# EAGLE design EduRobController (EAGLE 9.6.2)
REV: 1.0.0

## Sheet 1 of 3: Logic
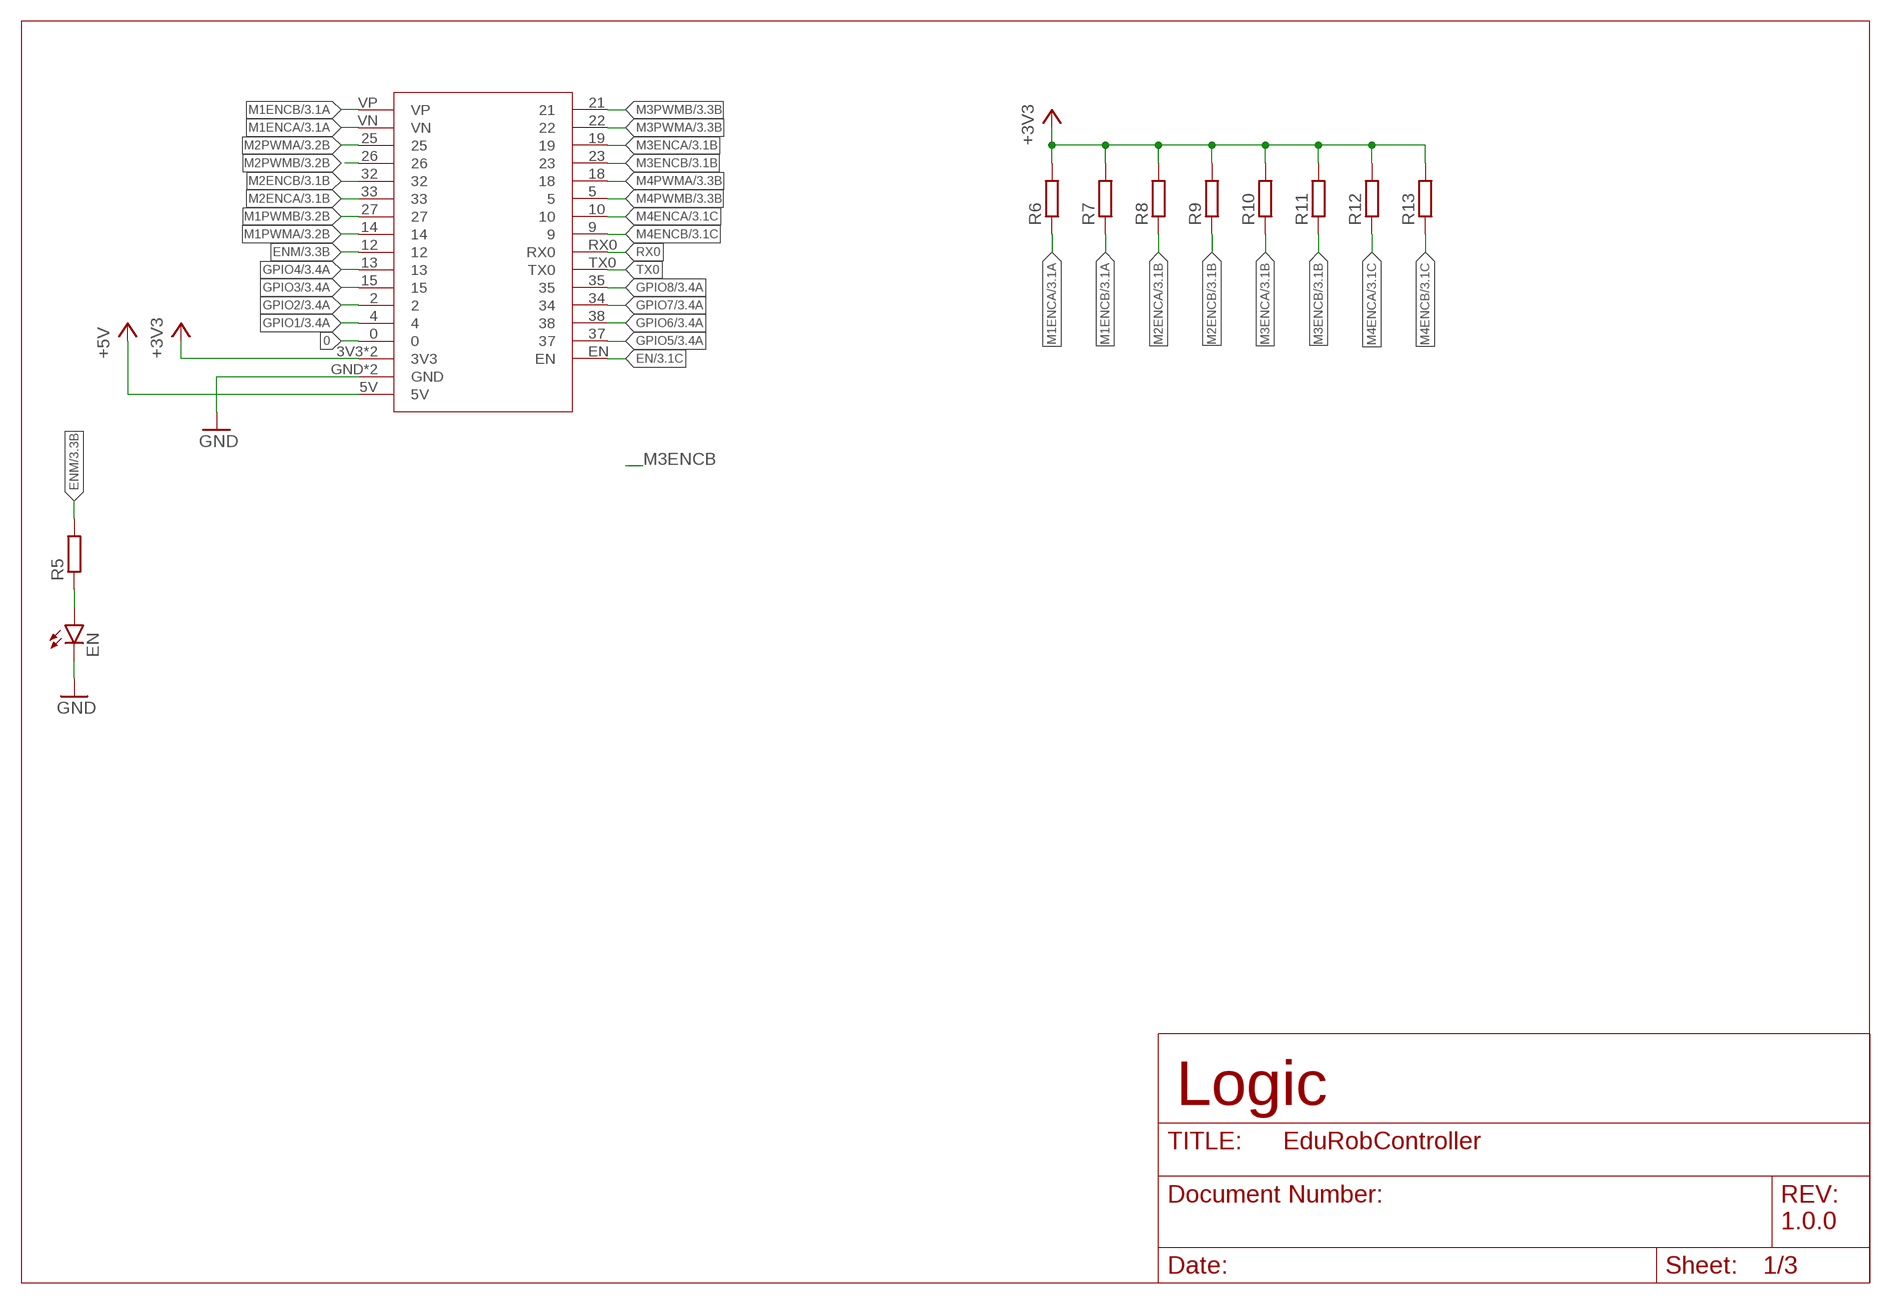
[diagram p0: schematic, sheet 1]

### Parts
EN  LEDCHIP-LED0805  [CHIP-LED0805]
R5  R-EU_R0805  [R0805]
R6  R-EU_R0603  [R0603]
R7  R-EU_R0603  [R0603]
R8  R-EU_R0603  [R0603]
R9  R-EU_R0603  [R0603]
R10  R-EU_R0603  [R0603]
R11  R-EU_R0603  [R0603]
R12  R-EU_R0603  [R0603]
R13  R-EU_R0603  [R0603]
U$1  ESP32  [ESP32]

### Nets
0: U$1.0
+3V3: R6.2 R7.2 R8.2 R9.2 R10.2 R11.2 R12.2 R13.2 U$1.3V3 U$1.3V3.(3V3) ; also sheet 2,3
+5V: U$1.5V ; also sheet 2,3
EN: U$1.EN ; also sheet 3
ENM: R5.2 U$1.12 ; also sheet 3
GND: EN.C U$1.GND U$1.GND.(GND) ; also sheet 2,3
GPIO1: U$1.4 ; also sheet 3
GPIO2: U$1.2 ; also sheet 3
GPIO3: U$1.15 ; also sheet 3
GPIO4: U$1.13 ; also sheet 3
GPIO5: U$1.37 ; also sheet 3
GPIO6: U$1.38 ; also sheet 3
GPIO7: U$1.34 ; also sheet 3
GPIO8: U$1.35 ; also sheet 3
M1ENCA: R6.1 U$1.VN ; also sheet 3
M1ENCB: R7.1 U$1.VP ; also sheet 3
M1PWMA: U$1.14 ; also sheet 3
M1PWMB: U$1.27 ; also sheet 3
M2ENCA: R8.1 U$1.33 ; also sheet 3
M2ENCB: R9.1 U$1.32 ; also sheet 3
M2PWMA: U$1.25 ; also sheet 3
M2PWMB: U$1.26 ; also sheet 3
M3ENCA: R10.1 U$1.19 ; also sheet 3
M3ENCB: R11.1 U$1.23 ; also sheet 3
M3PWMA: U$1.22 ; also sheet 3
M3PWMB: U$1.21 ; also sheet 3
M4ENCA: R12.1 U$1.10 ; also sheet 3
M4ENCB: R13.1 U$1.9 ; also sheet 3
M4PWMA: U$1.18 ; also sheet 3
M4PWMB: U$1.5 ; also sheet 3
N$7: EN.A R5.1
RX0: U$1.RX0
TX0: U$1.TX0

## Sheet 2 of 3: Power
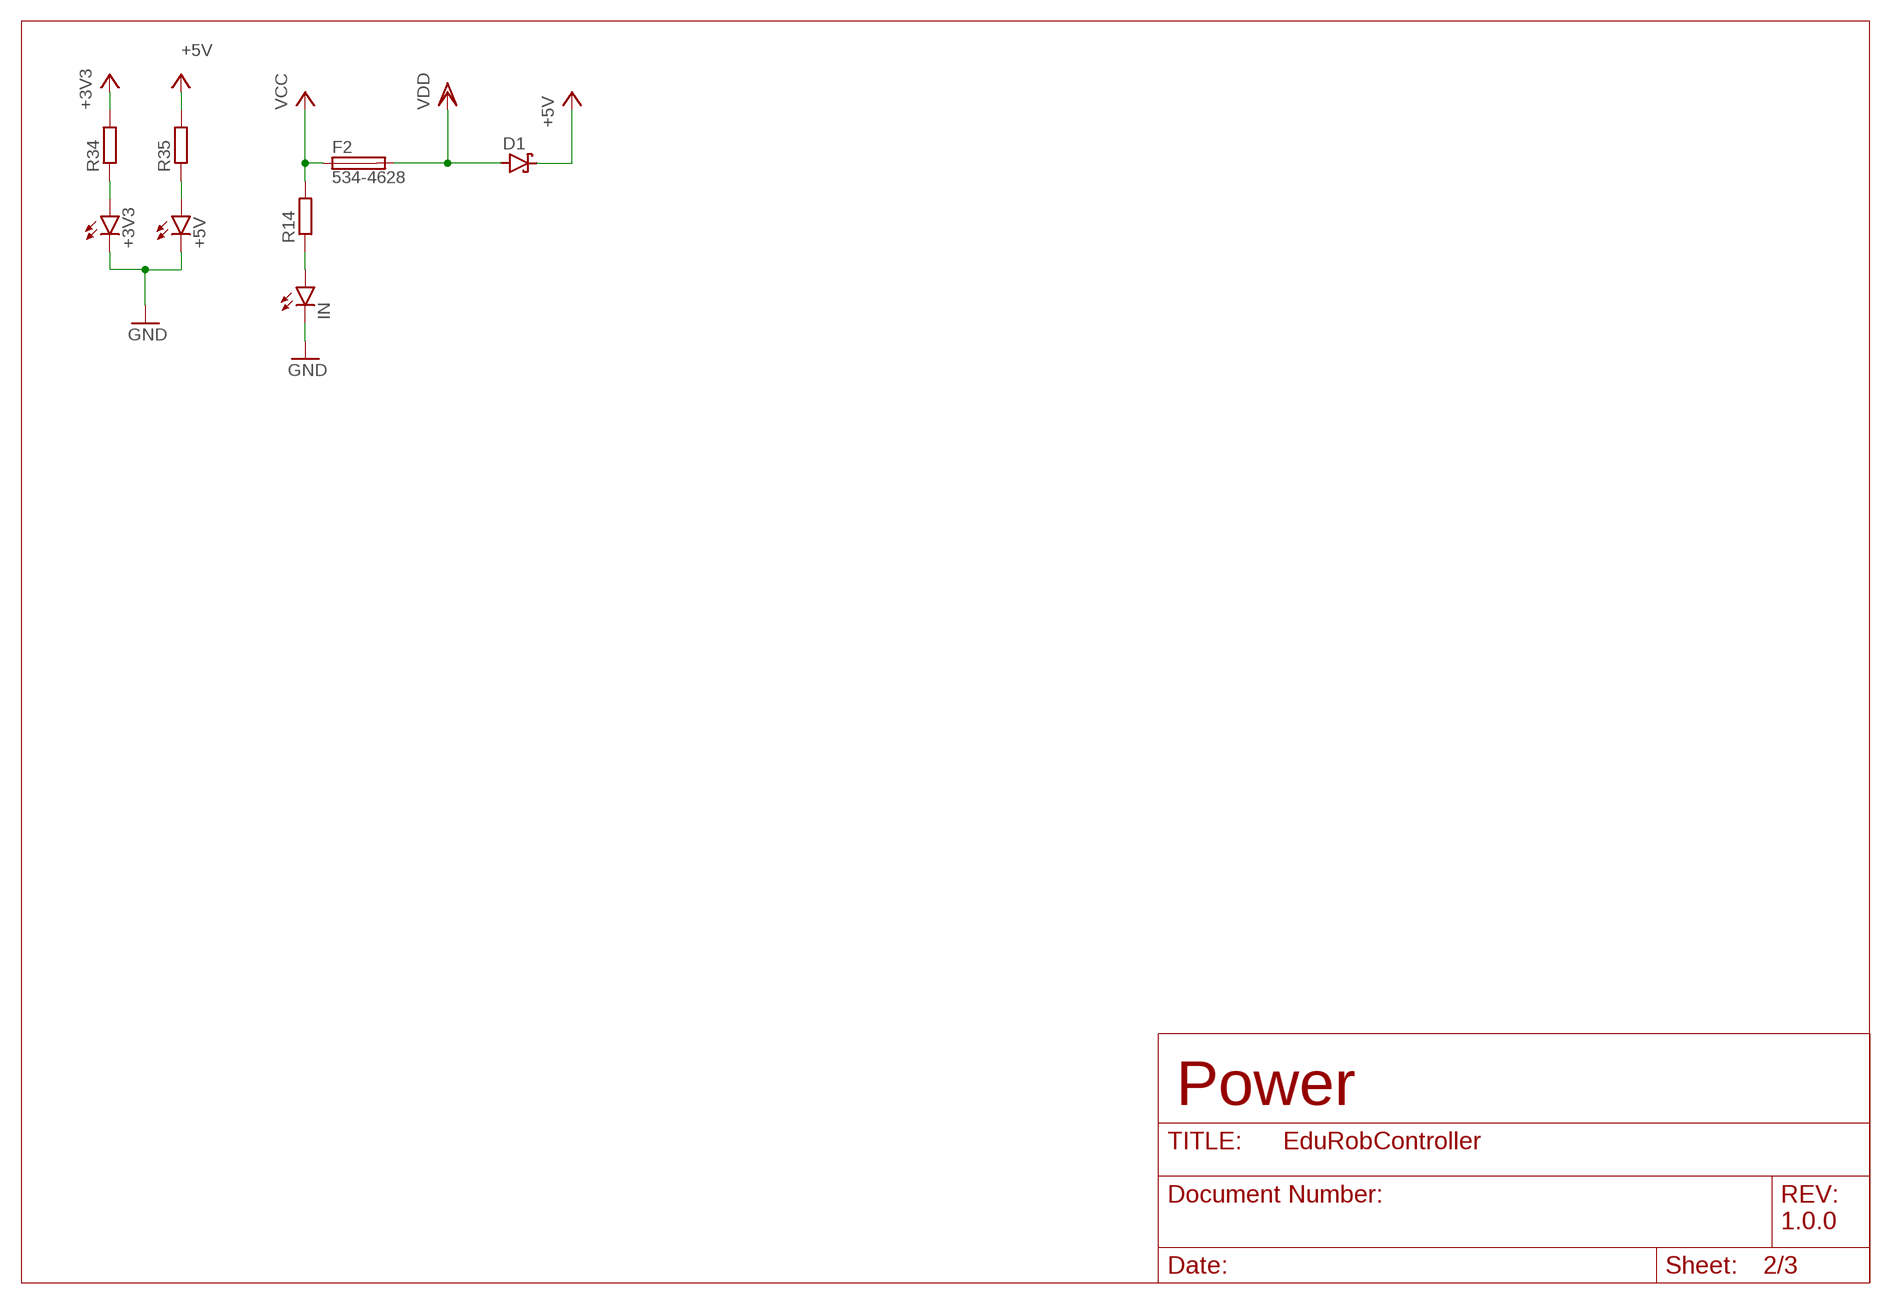
[diagram p1: schematic, sheet 2]

### Parts
+3V3  LEDCHIP-LED0805  [CHIP-LED0805]
+5V  LEDCHIP-LED0805  [CHIP-LED0805]
D1  SCHOTTKY-DIODESMD  [SMB]
F2  534-4628  SH22,5  [SH22,5]
IN  LEDCHIP-LED0805  [CHIP-LED0805]
R14  R-EU_R0805  [R0805]
R34  R-EU_R0805  [R0805]
R35  R-EU_R0805  [R0805]

### Nets
+3V3: R34.2 ; also sheet 1,3
+5V: D1.C R35.2 ; also sheet 1,3
GND: +3V3.C +5V.C IN.C ; also sheet 1,3
N$1: +3V3.A R34.1
N$3: +5V.A R35.1
N$9: IN.A R14.1
VCC: F2.1 R14.2 ; also sheet 3
VDD: D1.A F2.2 ; also sheet 3

## Sheet 3 of 3: Connectors
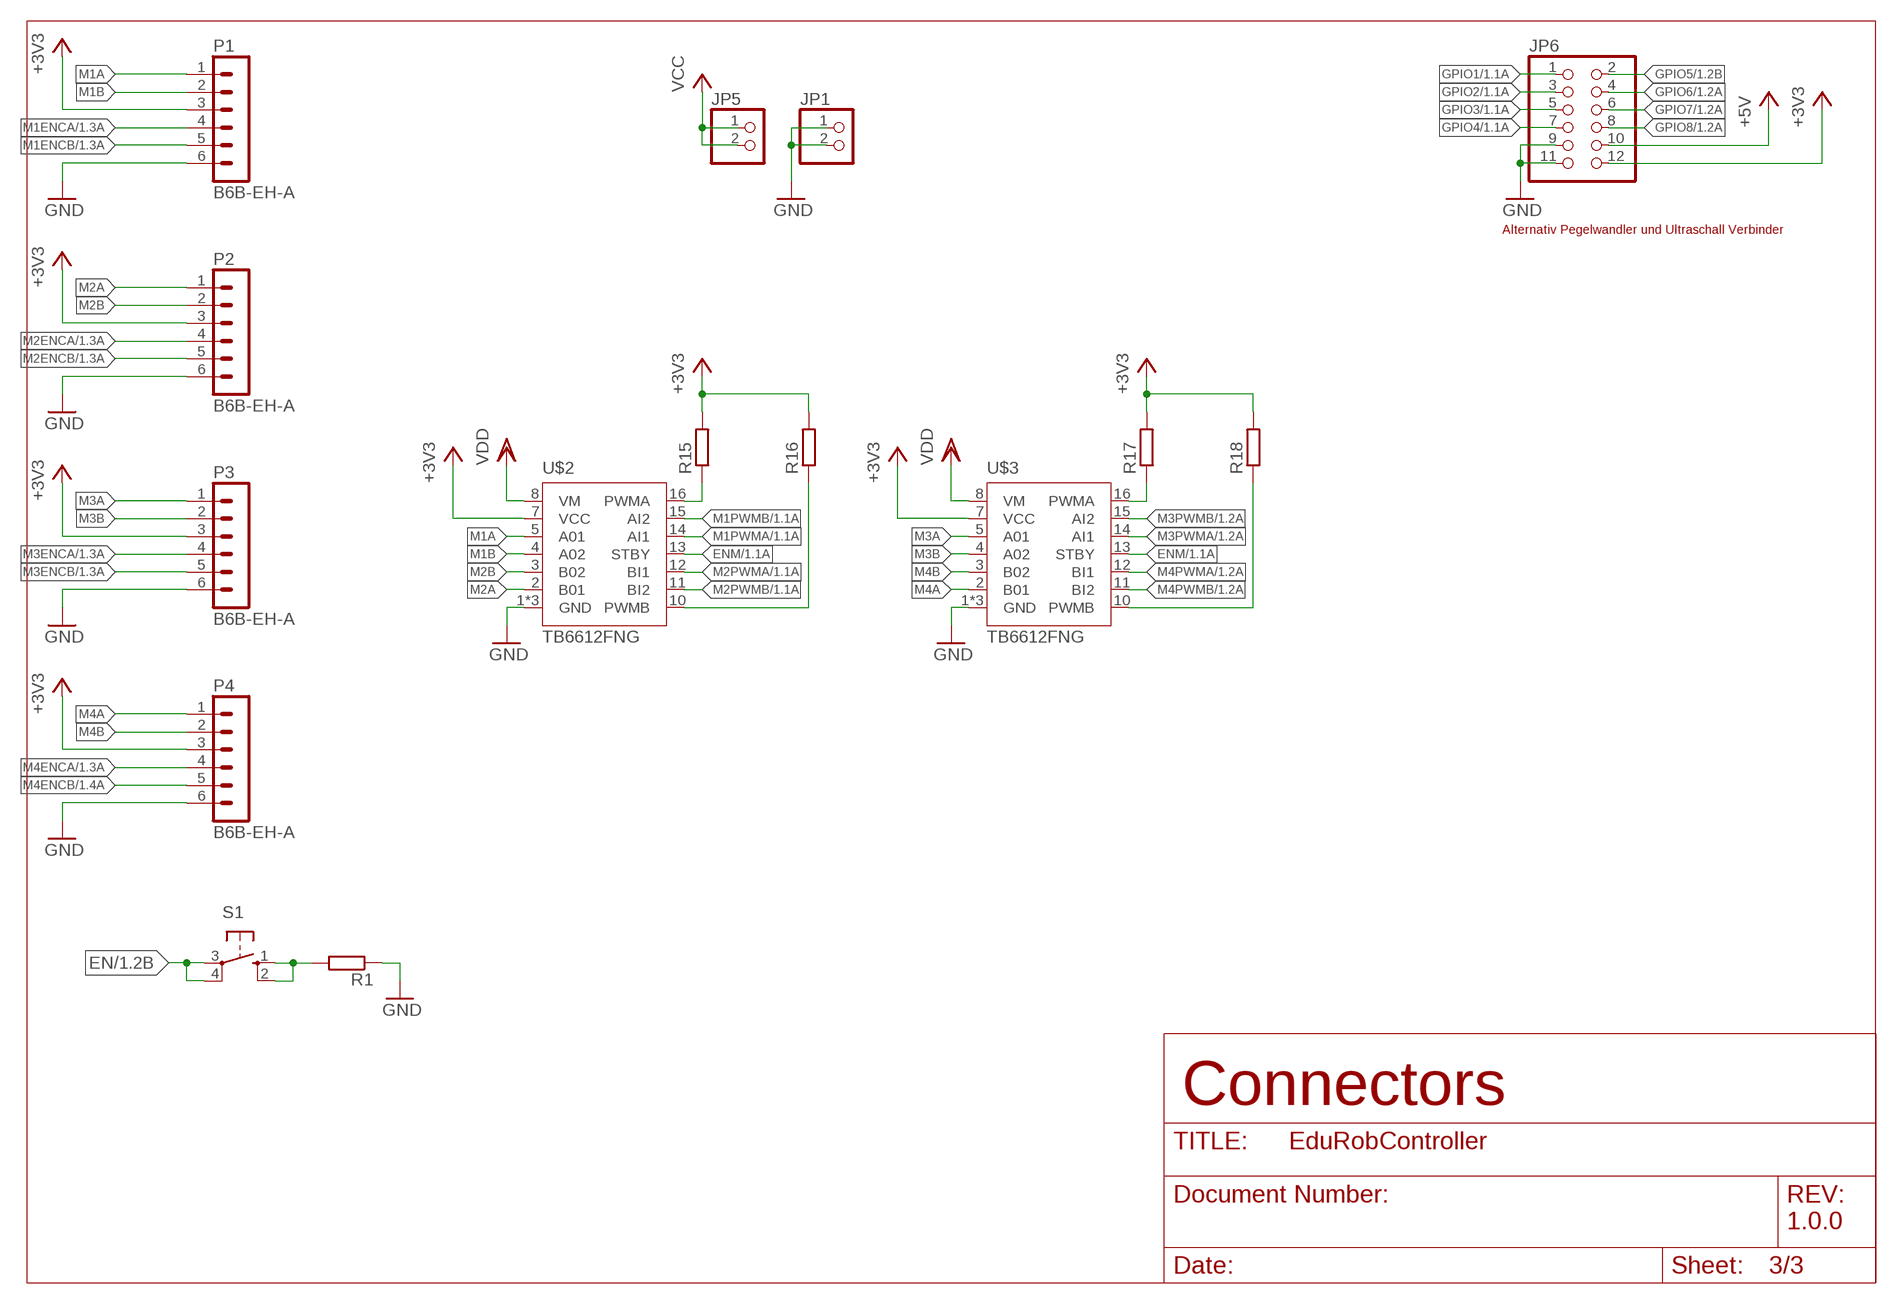
[diagram p2: schematic, sheet 3]

### Parts
JP1  PINHD-1X2  [1X02]
JP5  PINHD-1X2  [1X02]
JP6  PINHD-2X6  [2X06]
P1  B6B-EH-A  [B6B-EH-A]
P2  B6B-EH-A  [B6B-EH-A]
P3  B6B-EH-A  [B6B-EH-A]
P4  B6B-EH-A  [B6B-EH-A]
R1  R-EU_R0603  [R0603]
R15  R-EU_R0603  [R0603]
R16  R-EU_R0603  [R0603]
R17  R-EU_R0603  [R0603]
R18  R-EU_R0603  [R0603]
S1  10-XX  [B3F-10XX]
U$2  TB6612FNG  [2X08]
U$3  TB6612FNG  [2X08]

### Nets
+3V3: JP6.12 P1.3 P2.3 P3.3 P4.3 R15.2 R16.2 R17.2 R18.2 U$2.7(VCC) U$3.7(VCC) ; also sheet 1,2
+5V: JP6.10 ; also sheet 1,2
EN: S1.3(P) S1.4(P1) ; also sheet 1
ENM: U$2.13(STBY) U$3.13(STBY) ; also sheet 1
GND: JP1.1 JP1.2 JP6.9 JP6.11 P1.6 P2.6 P3.6 P4.6 R1.1 U$2.1(GND) U$2.6(GND) U$2.9(GND) U$3.1(GND) U$3.6(GND) U$3.9(GND) ; also sheet 1,2
GPIO1: JP6.1 ; also sheet 1
GPIO2: JP6.3 ; also sheet 1
GPIO3: JP6.5 ; also sheet 1
GPIO4: JP6.7 ; also sheet 1
GPIO5: JP6.2 ; also sheet 1
GPIO6: JP6.4 ; also sheet 1
GPIO7: JP6.6 ; also sheet 1
GPIO8: JP6.8 ; also sheet 1
M1A: P1.1 U$2.5(A01)
M1B: P1.2 U$2.4(A02)
M1ENCA: P1.4 ; also sheet 1
M1ENCB: P1.5 ; also sheet 1
M1PWMA: U$2.14(AI1) ; also sheet 1
M1PWMB: U$2.15(AI2) ; also sheet 1
M2A: P2.1 U$2.2(B01)
M2B: P2.2 U$2.3(B02)
M2ENCA: P2.4 ; also sheet 1
M2ENCB: P2.5 ; also sheet 1
M2PWMA: U$2.12(BI1) ; also sheet 1
M2PWMB: U$2.11(BI2) ; also sheet 1
M3A: P3.1 U$3.5(A01)
M3B: P3.2 U$3.4(A02)
M3ENCA: P3.4 ; also sheet 1
M3ENCB: P3.5 ; also sheet 1
M3PWMA: U$3.14(AI1) ; also sheet 1
M3PWMB: U$3.15(AI2) ; also sheet 1
M4A: P4.1 U$3.2(B01)
M4B: P4.2 U$3.3(B02)
M4ENCA: P4.4 ; also sheet 1
M4ENCB: P4.5 ; also sheet 1
M4PWMA: U$3.12(BI1) ; also sheet 1
M4PWMB: U$3.11(BI2) ; also sheet 1
N$2: R1.2 S1.1(S) S1.2(S1)
N$10: R17.1 U$3.16(PWMA)
N$11: R18.1 U$3.10(PWMB)
N$14: R15.1 U$2.16(PWMA)
N$15: R16.1 U$2.10(PWMB)
VCC: JP5.1 JP5.2 ; also sheet 2
VDD: U$2.8(VM) U$3.8(VM) ; also sheet 2

### Notes on the sheet
- Alternativ Pegelwandler und Ultraschall Verbinder

## Library data of the parts
+3V3 +5V EN IN = led:LED: LED OSRAM: - CHIPLED LG R971, LG N971, LY N971, LG Q971, LY Q971, LO R971, LY R971 LH N974, LH R974 LS Q976, LO Q976, LY Q976 LO Q996 - Hyper CHIPLED LW Q18S LB Q993, LB Q99A, LB R99A - SideLED LS A670, LO A670, LY A670, LG A670, LP A670 LB A673, LV A673, LT A673, LW A673 LH A674 LY A675 LS A676, LA A676, LO A676, LY A676, LW A676 LS A679, LY A679, LG A679 - Hyper Micro SIDELED® LS Y876, LA Y876, LO Y876, LY Y876 LT Y87S - SmartLED LW L88C, LW L88S LB L89C, LB L89S, LG L890 LS L89K, LO L89K, LY L89K LS L896, LA L896, LO L896, LY L896 - TOPLED LS T670, LO T670, LY T670, LG T670, LP T670 LSG T670, LSP T670, LSY T670, LOP T670, LYG T670 LG T671, LOG T671, LSG T671 LB T673, LV T673, LT T673, LW T673 LH T674 LS T676, LA T676, LO T676, LY T676, LB T676, LH T676, LSB T676, LW T676 LB T67C, LV T67C, LT T67C, LS T67K, LO T67K, LY T67K, LW E67C LS E67B, LA E67B, LO E67B, LY E67B, LB E67C, LV E67C, LT E67C LW T67C LS T679, LY T679, LG T679 LS T770, LO T770, LY T770, LG T770, LP T770 LB T773, LV T773, LT T773, LW T773 LH T774 LS E675, LA E675, LY E675, LS T675 LS T776, LA T776, LO T776, LY T776, LB T776 LHGB T686 LT T68C, LB T68C - Hyper Mini TOPLED® LB M676 - Mini TOPLED Santana® LG M470 LS M47K, LO M47K, LY M47K Source: http://www.osram.convergy.de LUXEON: - LUMILED® LXK2-PW12-R00, LXK2-PW12-S00, LXK2-PW14-U00, LXK2-PW14-V00 LXK2-PM12-R00, LXK2-PM12-S00, LXK2-PM14-U00 LXK2-PE12-Q00, LXK2-PE12-R00, LXK2-PE12-S00, LXK2-PE14-T00, LXK2-PE14-U00 LXK2-PB12-K00, LXK2-PB12-L00, LXK2-PB12-M00, LXK2-PB14-N00, LXK2-PB14-P00, LXK2-PB14-Q00 LXK2-PR12-L00, LXK2-PR12-M00, LXK2-PR14-Q00, LXK2-PR14-R00 LXK2-PD12-Q00, LXK2-PD12-R00, LXK2-PD12-S00 LXK2-PH12-R00, LXK2-PH12-S00 LXK2-PL12-P00, LXK2-PL12-Q00, LXK2-PL12-R00 Source: www.luxeon.com KINGBRIGHT: KA-3528ASYC Source: www.kingbright.com
D1 = diode:SCHOTTKY-DIODE: Schottky Diode
F2 = fuse:SH22,5: FUSE HOLDER grid 22,5 mm, OGN0031 8201, Schurter (Buerklin); MF: SCHURTER; MPN: 0031.8201; OC_FARNELL: 1162740; OC_NEWARK: 96F8317
JP1 JP5 = pinhead:PINHD-1X2: PIN HEADER
JP6 = pinhead:PINHD-2X6: PIN HEADER
P1-P4 = con-jst-eh:B6B-EH-A: HEADER
R1 R5-R18 R34 R35 = rcl:R-EU_: RESISTOR, European symbol; SPICEPREFIX: R
S1 = switch-omron:10-XX: OMRON SWITCH; MPN: B3F-1000; OC_FARNELL: 176432; OC_NEWARK: 36M3542
U$1 = ESP32:ESP32
U$2 U$3 = untitled:TB6612FNG

## Board
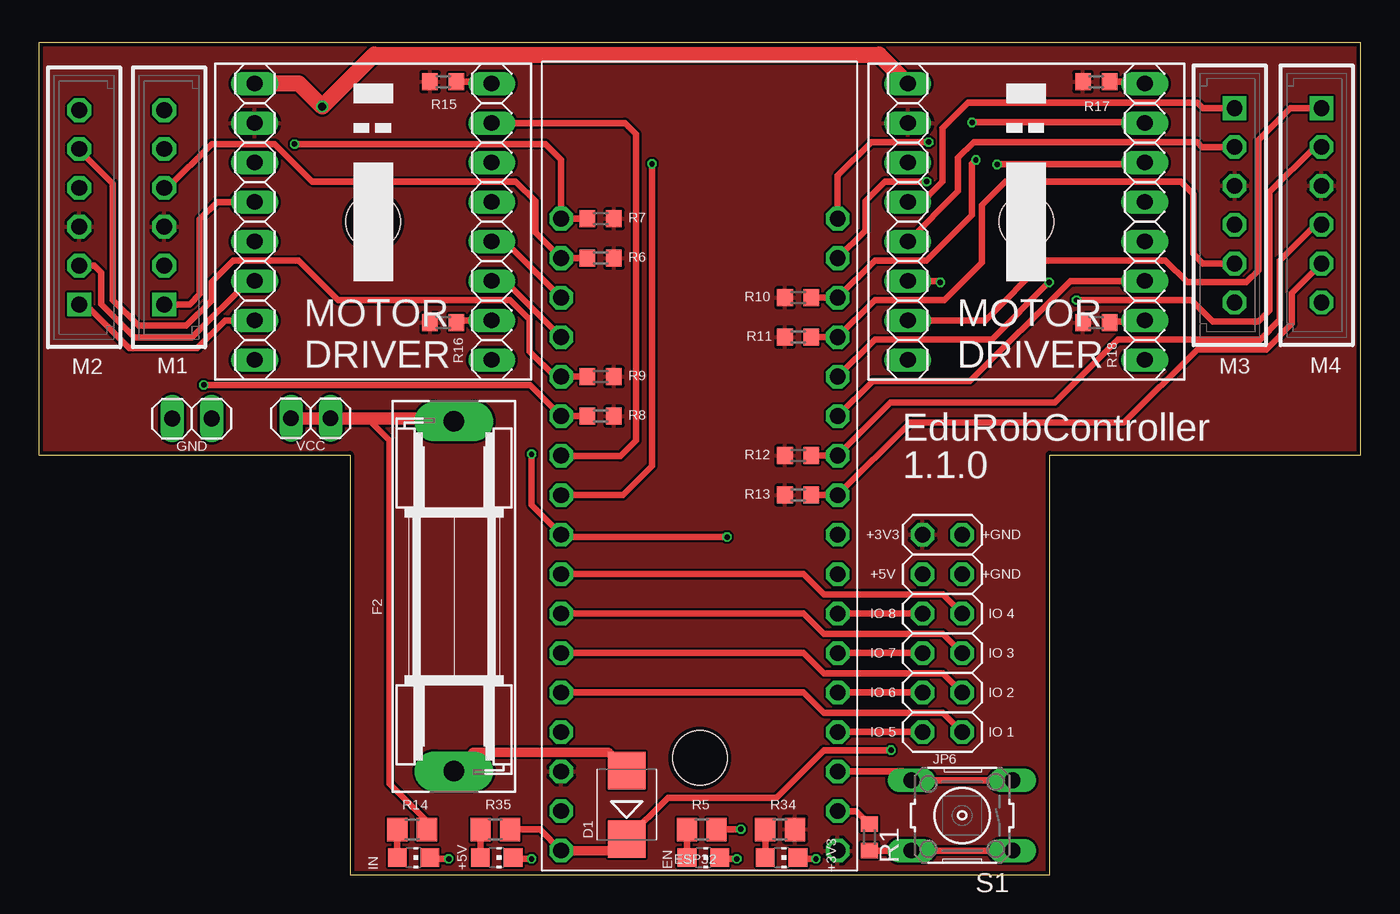
[diagram p3: board, top side]
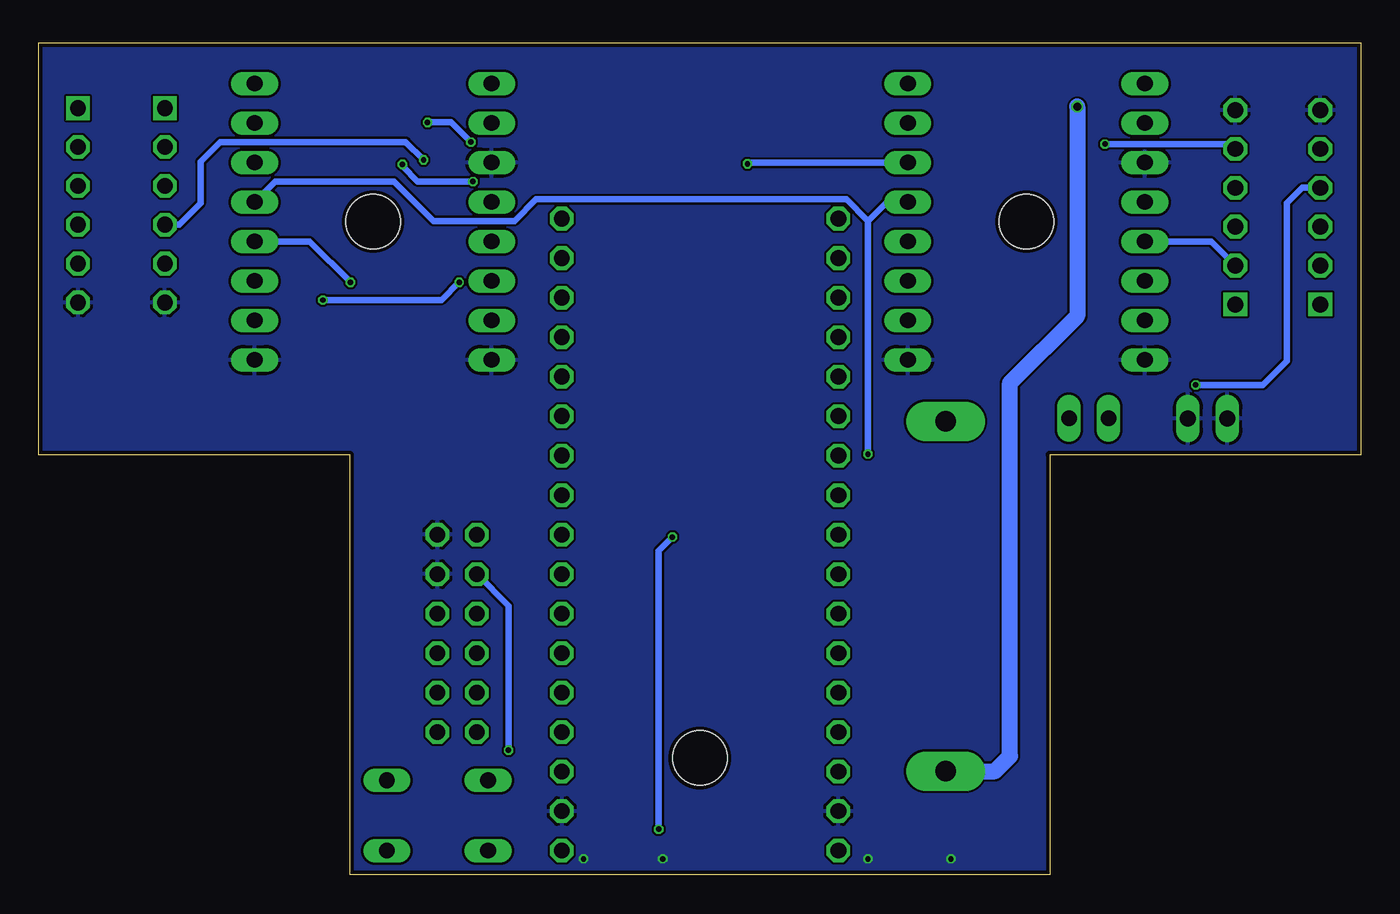
[diagram p4: board, bottom side, seen from below]

Size 85 x 53.5 mm. Coordinates in mm from the lower left corner, seen from the top.
Outline: 20,0 65,0 65,27 85,27 85,53.5 0,53.5 0,27 20,27 20,0
Copper layers (1*16): Top 0.018mm / dielectric 1.55mm / Bottom 0.018mm
Design rules "eC_2Layer_PClass6_BaseCopperO18_eCDefault": minimum track width 0.15mm, minimum drill 0.35mm, track to track 0.15mm, track to pad 0.15mm, pad to pad 0.15mm, via to via 0.15mm, smd to smd 0mil, copper to edge 0.25mm, drill to drill 0.35mm, minimum pad ring 0.175mm, minimum via ring 0.125mm, stop-mask expansion 0mil, vias tented up to drill 0.45mm, thermal gap 0.2mm
Holes 3.5 mm at 42.5,7.5 21.5,42 63.5,42

### Footprints (pad centres in the part's own frame; a part is rotated, then mirrored left to right if it is on the bottom)
CHIP-LED0805 = smd 1.2 x 1.2: A 0,-1.05; C 0,1.05
SMB = smd 2.4 x 2.4: A 2.2,0; C -2.2,0
SH22,5 = drill 1.321 pad 2.54 long: 1 -11.252,0; 2 11.252,0
1X02 = drill 1.016 long: 1 -1.27,0; 2 1.27,0
2X06 = drill 1.016 octagon: 1 -6.35,-1.27; 2 -6.35,1.27; 3 -3.81,-1.27; 4 -3.81,1.27; 5 -1.27,-1.27; 6 -1.27,1.27; 7 1.27,-1.27; 8 1.27,1.27; 9 3.81,-1.27; 10 3.81,1.27; 11 6.35,-1.27; 12 6.35,1.27
B6B-EH-A = drill 1.016 square: 1 -6.25,0 | drill 1.016 octagon: 2 -3.75,0; 3 -1.25,0; 4 1.25,0; 5 3.75,0; 6 6.25,0
R0603 = smd 1 x 1.1: 1 -0.85,0; 2 0.85,0
R0805 = smd 1.3 x 1.5: 1 -0.95,0; 2 0.95,0
B3F-10XX = drill 1.016 long: 1 -3.251,2.261; 2 3.251,2.261; 3 -3.251,-2.261; 4 3.251,-2.261
ESP32 = drill 1.016 octagon: 0 8.89,19.05; 2 13.97,19.05; 3V3 6.35,19.05; 3V3. 1.27,1.27; 4 11.43,19.05; 5 29.21,1.27; 5V 1.27,19.05; 9 24.13,1.27; 10 26.67,1.27; 12 21.59,19.05; 13 19.05,19.05; 14 24.13,19.05; 15 16.51,19.05; 18 31.75,1.27; 19 36.83,1.27; 21 41.91,1.27; 22 39.37,1.27; 23 34.29,1.27; 25 36.83,19.05; 26 34.29,19.05; 27 26.67,19.05; 32 31.75,19.05; 33 29.21,19.05; 34 13.97,1.27; 35 16.51,1.27; 37 8.89,1.27; 38 11.43,1.27; EN 6.35,1.27; GND 3.81,19.05; GND. 3.81,1.27; RX0 21.59,1.27; TX0 19.05,1.27; VN 39.37,19.05; VP 41.91,19.05
2X08 = drill 1.016 long: 1 -7.62,-8.89; 2 -7.62,-6.35; 3 -7.62,-3.81; 4 -7.62,-1.27; 5 -7.62,1.27; 6 -7.62,3.81; 7 -7.62,6.35; 8 -7.62,8.89; 9 7.62,-8.89; 10 7.62,-6.35; 11 7.62,-3.81; 12 7.62,-1.27; 13 7.62,1.27; 14 7.62,3.81; 15 7.62,6.35; 16 7.62,8.89

### Placement (x,y rotation side)
+3V3  47.77,1.1 270 top
+5V  29.45,1.1 270 top
D1  37.8,4.5 90 top
EN  42.73,1.1 270 top
F2  26.7,17.9 270 top
IN  24.1,1.1 270 top
JP1  9.84,29.34 0 top
JP5  17.48,29.35 180 top
JP6  58.1,15.52 90 top
P1  8.06,42.93 90 top
P2  2.6,42.93 90 top
P3  76.9,43.05 270 top
P4  82.48,43.05 270 top
R1  53.4,2.41 270 top
R5  42.62,2.91 0 top
R6  36.13,39.65 0 top
R7  36.13,42.19 0 top
R8  36.13,29.49 0 top
R9  36.13,32.03 0 top
R10  48.83,37.11 180 top
R11  48.83,34.57 180 top
R12  48.83,26.95 180 top
R13  48.83,24.41 180 top
R14  24,2.9 0 top
R15  26,51 180 top
R16  26,35.5 180 top
R17  68,51 180 top
R18  68,35.5 180 top
R34  47.67,2.91 0 top
R35  29.35,2.91 0 top
S1  59.37,3.81 180 top
U$1  52.64,0.28 90 top
U$2  21.5,42 0 top
U$3  63.5,42 0 top

### Tracks (layer width: path | path; a pad name or v marks a point on that pad's centre or on a via)
+3V3
  pour Top: -3.12,54 -3.12,-0.5 88.12,-0.5 88.12,54
+5V  (via drill 0.35)
  Top 0.406: R35.2 32.23,2.91 U$1.5V | v54.8,8 50.48,8 47.43,4.95 40.45,4.95 D1.C
  Top 0.61: U$1.5V 37.05,1.55 D1.C
  Bottom 0.406: v54.8,8 54.8,17.3 JP6.10
EN
  Top 0.406: U$1.EN 55.56,6.63 S1.4 S1.3
ENM  (via drill 0.35)
  Top 0.406: v31.68,27.05 31.68,23.78 U$1.12 33.74,21.72 v44.26,21.72 | R5.2 45.13,2.91 v45.15,2.92
  Bottom 0.406: v31.68,27.05 31.68,42.04 | U$2.13 30.45,43.27 31.68,42.04 | 31.68,42.04 33.08,43.43 53.02,43.43 54.42,42.04 59.62,42.04 62.16,44.58 69.81,44.58 U$3.13 | v44.26,21.72 45.15,20.83 v45.15,2.92
GND  (via drill 0.35)
  Top 0.406: IN.C 25.15,1.02 v26.35,1.02 | +5V.C 30.5,1.02 v31.68,1.02 | EN.C 43.86,1.02 v44.88,1.02 | +3V3.C 48.9,1.02 v49.97,1.02 | U$1.GND. 52.57,4.09 R1.1
  pour Bottom: -3.62,54.5 -3.62,-1 88.62,-1 88.62,54.5
GPIO1
  Top 0.406: JP6.1 58.13,10.41 50.48,10.41 49.18,11.71 U$1.4
GPIO2
  Top 0.406: JP6.3 58.13,12.95 50.48,12.95 49.18,14.25 U$1.2
GPIO3
  Top 0.406: JP6.5 58.13,15.49 50.48,15.49 49.18,16.79 U$1.15
GPIO4
  Top 0.406: JP6.7 58.13,18.03 50.48,18.03 49.18,19.33 U$1.13
GPIO5
  Top 0.406: U$1.37 JP6.2
GPIO6
  Top 0.406: U$1.38 JP6.4
GPIO7
  Top 0.406: U$1.34 JP6.6
GPIO8
  Top 0.406: U$1.35 JP6.8
M1A
  Top 0.406: U$2.5 11.45,43.27 10.35,42.16 10.35,37.34 9.69,36.68 P1.1
M1B
  Bottom 0.406: P1.2 9.62,40.73 U$2.4
M1ENCA
  Top 0.406: R6.1 U$1.VN 31.94,41.3 31.94,43.31 30.67,44.58 17.59,44.58 15.17,46.99 11.11,46.99 8.3,44.18 P1.4
M1ENCB  (via drill 0.35)
  Top 0.406: R7.1 U$1.VP 33.59,45.97 32.57,46.99 v16.44,46.99
  Bottom 0.406: P1.5 8.38,46.99 v16.44,46.99
M1PWMA  (via drill 0.35)
  Top 0.406: U$1.14 37.55,24.41 39.43,26.29 v39.43,45.72
  Bottom 0.406: v39.43,45.72 39.34,45.81 U$2.14
M1PWMB
  Top 0.406: U$2.15 37.69,48.35 38.41,47.62 38.41,27.94 37.4,26.92 33.62,26.92 U$1.27
M2A
  Top 0.406: U$2.2 11.97,35.65 10.19,33.86 5.82,33.86 3.01,36.68 P2.1
M2B
  Top 0.406: U$2.3 13.49,38.19 9.84,34.54 6.16,34.54 4,36.7 4,38.73 3.56,39.18 P2.2
M2ENCA  (via drill 0.35)
  Top 0.406: R8.1 U$1.33 31.58,31.5 v10.6,31.5
  Bottom 0.406: P2.4 3.76,44.18 4.76,43.18 4.76,33.02 6.28,31.5 v10.6,31.5
M2ENCB
  Top 0.406: R9.1 U$1.32 33.18,32.03 31.56,33.66 31.56,35.69 30.29,36.96 19.24,36.96 16.7,39.5 12.51,39.5 11.11,38.1 11.11,36.94 9.48,35.31 6.41,35.31 4.76,36.96 4.76,44.45 2.6,46.61 P2.5
M2PWMA
  Top 0.406: U$1.25 29.97,40.73 U$2.12
M2PWMB
  Top 0.406: U$1.26 29.97,38.19 U$2.11
M3A
  Top 0.406: U$3.5 56.79,43.27 58.1,44.58 58.1,48.01 59.75,49.66 74.48,49.66 74.84,49.3 P3.1
M3B
  Top 0.406: U$3.4 59.12,43.97 59.12,46.1 60.13,47.12 74.48,47.12 74.8,46.8 P3.2
M3ENCA  (via drill 0.35)
  Top 0.406: R10.1 U$1.19 53.76,39.5 57.08,39.5 60.01,42.42 60.01,45.72 v60.26,45.97
  Bottom 0.406: v60.26,45.97 61.4,47.12 73.34,47.12 74.61,45.85 74.61,43.18 75.99,41.8 P3.4
M3ENCB
  Top 0.406: R11.1 U$1.23 53.76,36.96 58.23,36.96 60.64,39.37 60.64,43.05 62.16,44.58 73.42,44.58 74.23,43.77 74.23,39.94 74.86,39.3 P3.5
M3PWMA  (via drill 0.35)
  Top 0.406: U$1.22 53.15,41.43 53.15,43.31 54.42,44.58 v57.08,44.58 | U$3.14 70.99,45.68 v61.62,45.68
  Bottom 0.406: v57.08,44.58 60.64,44.58 61.62,45.56 v61.62,45.68
M3PWMB  (via drill 0.35)
  Top 0.406: U$1.21 51.37,44.96 53.53,47.12 v57.21,47.12 | v60.01,48.39 71.08,48.39 U$3.15
  Bottom 0.406: v57.21,47.12 58.48,48.39 v60.01,48.39
M4A
  Top 0.406: U$3.2 60.86,35.65 64.7,39.5 72.45,39.5 73.85,38.1 77.66,38.1 78.42,38.86 78.42,47.24 80.48,49.3 P4.1
M4B  (via drill 0.35)
  Top 0.406: U$3.3 57.88,38.19 v57.97,38.1 | v66.74,36.96 74.1,36.96 75.5,35.56 78.42,35.56 79.13,36.27 79.13,43.89 82.04,46.8 P4.2
  Bottom 0.406: v57.97,38.1 59.12,36.96 v66.74,36.96
M4ENCA
  Top 0.406: R12.1 U$1.10 54.77,30.35 65.34,30.35 69.4,34.42 78.55,34.42 79.82,35.69 79.82,39.5 82.12,41.8 P4.4
M4ENCB
  Top 0.406: R13.1 U$1.9 56.04,29.08 69.78,29.08 74.48,33.78 78.93,33.78 80.58,35.43 80.58,37.4 P4.5
M4PWMA  (via drill 0.35)
  Top 0.406: U$1.18 53.76,34.42 61.27,34.42 v64.96,38.1
  Bottom 0.406: v64.96,38.1 67.59,40.73 U$3.12
M4PWMB
  Top 0.406: U$3.11 66.32,38.19 59.88,31.75 53.63,31.75 U$1.5
N$1
  Top 0.406: R34.1 +3V3.A
N$2
  Top 0.406: R1.2 53.41,1.55 S1.2 S1.1
N$3
  Top 0.406: R35.1 +5V.A
N$7
  Top 0.406: R5.1 EN.A
N$9
  Top 0.406: IN.A R14.1
N$10
  Top 0.406: R17.1 71.01,51 U$3.16
N$11
  Top 0.406: R18.1 68.91,35.56 71.03,35.56 U$3.10
N$14
  Top 0.406: R15.1 29.01,51 U$2.16
N$15
  Top 0.406: R16.1 27,35.65 U$2.10
VCC
  Top 0.406: R14.2 24.95,3.43 22.54,5.84 22.54,27.94 21.13,29.35 20,29.35
  Top 0.813: F2.1 26.5,29.35 20,29.35 JP5.1 JP5.2
VDD  (via drill 0.5)
  Top 0.61: F2.2 27.93,7.87 36.63,7.87 D1.A
  Top 1.016: U$2.8 16.73,50.89 v18.22,49.4 21.56,52.74 54.03,52.74 U$3.8
  Bottom 1.016: F2.2 23.51,6.65 22.54,7.62 22.54,31.62 18.22,35.94 v18.22,49.4

### Text on the board
tPlace: M2 | M1 | M3 | M4 | GND | VCC | EduRobController | +3V3 / / / / +5V / / / / IO 8 / / / / IO 7 / / / / IO 6 / / / / IO 5 | +GND / / / / +GND / / / / IO 4 / / / / IO 3 / / / / IO 2 / / / / IO 1